# EAGLE design DCO (EAGLE 6.4)
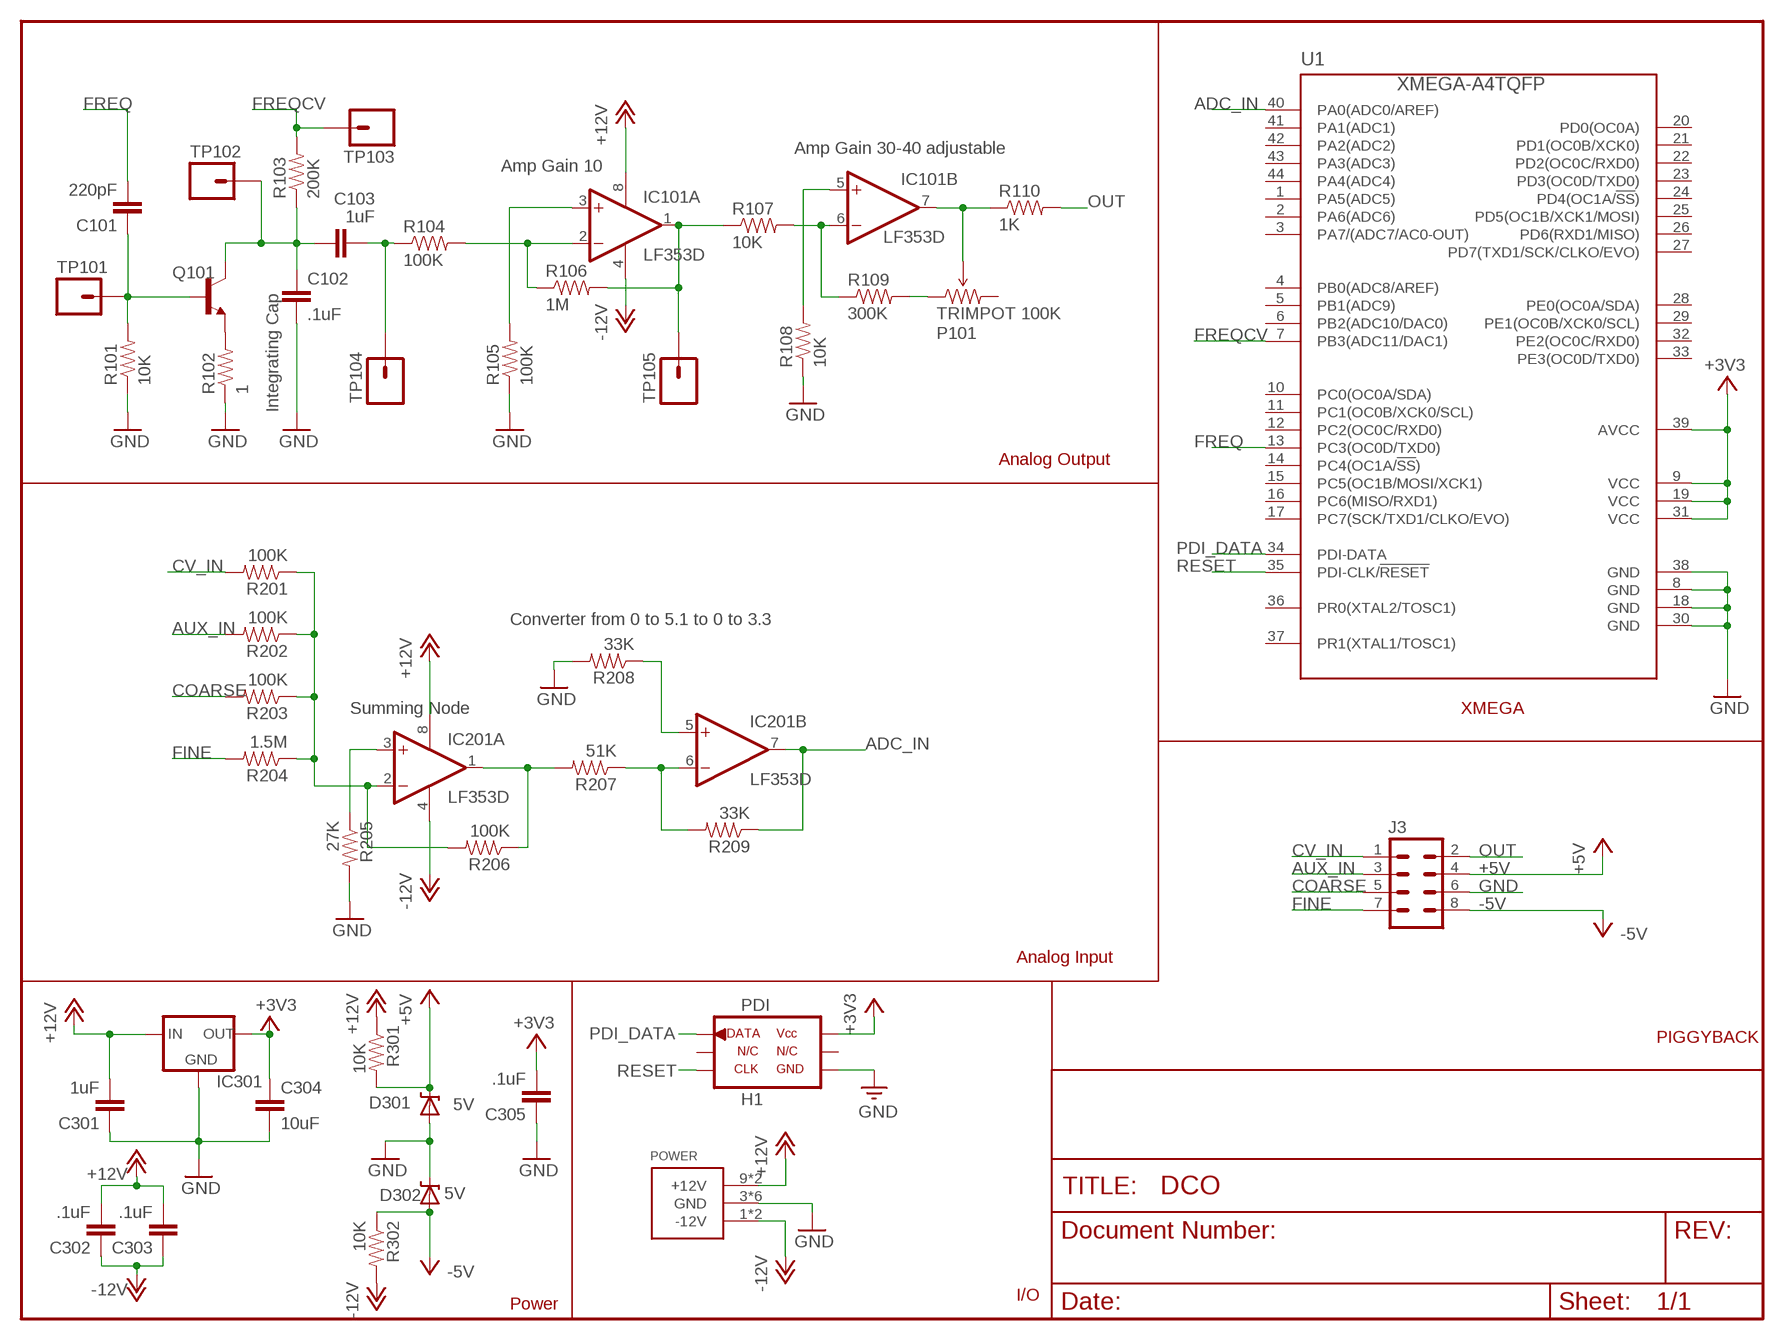
[diagram p0: schematic, sheet 1]

## Parts
C101  220pF  CAP0603-CAP  [0603-CAP]
C102  .1uF  CAP1210  [1210]
C103  1uF  CAP0805  [0805]
C301  1uF  CAP0805  [0805]
C302  .1uF  CAP0603-CAP  [0603-CAP]
C303  .1uF  CAP0603-CAP  [0603-CAP]
C304  10uF  CAP1206  [1206]
C305  .1uF  CAP0603-CAP  [0603-CAP]
D301  5V  DIODE-ZENER-BZT52  [SOD-323]
D302  5V  DIODE-ZENER-BZT52  [SOD-323]
H1  PDI  AVR_PDI_6  [AVR_ISP_6]
IC101  LF353D  [SO08]
IC201  LF353D  [SO08]
IC301  V_REG_MIC2920  [SOT223]
J3  M04X2  [2X4]
P101  TRIMPOT 100K  TRIMPOTPTH  [TRIM_POT_PTH]
POWER  POWER_SIMPLE16  [POWER_16]
Q101  TRANSISTOR_NPNSOT23  [SOT23]
R101  10K  RESISTOR0603-RES  [0603-RES]
R102  1  RESISTOR0805-RES  [0805]
R103  200K  RESISTOR0603-RES  [0603-RES]
R104  100K  RESISTOR0603-RES  [0603-RES]
R105  100K  RESISTOR0603-RES  [0603-RES]
R106  1M  RESISTOR0603-RES  [0603-RES]
R107  10K  RESISTOR0603-RES  [0603-RES]
R108  10K  RESISTOR0603-RES  [0603-RES]
R109  300K  RESISTOR0603-RES  [0603-RES]
R110  1K  RESISTOR0603-RES  [0603-RES]
R201  100K  RESISTOR0603-RES  [0603-RES]
R202  100K  RESISTOR0603-RES  [0603-RES]
R203  100K  RESISTOR0603-RES  [0603-RES]
R204  1.5M  RESISTOR0603-RES  [0603-RES]
R205  27K  RESISTOR0603-RES  [0603-RES]
R206  100K  RESISTOR0603-RES  [0603-RES]
R207  51K  RESISTOR0603-RES  [0603-RES]
R208  33K  RESISTOR0603-RES  [0603-RES]
R209  33K  RESISTOR0603-RES  [0603-RES]
R301  10K  RESISTOR0603-RES  [0603-RES]
R302  10K  RESISTOR0603-RES  [0603-RES]
TP101  M01PTH  [1X01]
TP102  M01PTH  [1X01]
TP103  M01PTH  [1X01]
TP104  M01PTH  [1X01]
TP105  M01PTH  [1X01]
U1  XMEGA-A4TQFP  [TQFP44]

## Nets
+3V3: C304.1 C305.2 H1.P$2(VCC_IO) IC301.3(OUT) U1.9(VCC) U1.19(VCC) U1.31(VCC) U1.39(AVCC)
+5V: D301.1(C) J3.4 R301.2
+12V: C301.2 C302.2 C303.2 IC101.8(P:V+) IC201.8(P:V+) IC301.1(IN) POWER.9(+12V) POWER.10(+12V) R301.1
-5V: D302.2(A) J3.8 R302.1
-12V: C302.1 C303.1 IC101.4(P:V-) IC201.4(P:V-) POWER.1(-12V) POWER.2(-12V) R302.2
ADC_IN: IC201.7(B:OUT) R209.1 U1.40(PA0(ADC0/AREF))
AUX_IN: J3.3 R202.2
COARSE: J3.5 R203.2
CV_IN: J3.1 R201.2
FINE: J3.7 R204.2
FREQ: C101.2 U1.13(PC3(OC0D/TXD0))
FREQCV: R103.2 TP103.1 U1.7(PB3(ADC11/DAC1))
GND: C102.2 C301.1 C304.2 C305.1 D301.2(A) D302.1(C) H1.P$6(GND) IC301.2(GND) J3.6 POWER.3(GND) POWER.4(GND) POWER.5(GND) POWER.6(GND) POWER.7(GND) POWER.8(GND) R101.1 R102.1 R105.1 R108.1 R205.2 R208.2 U1.8(GND) U1.18(GND) U1.30(GND) U1.38(GND)
N$1: C102.1 C103.1 Q101.3(C) R103.1 TP102.1
N$2: C101.1 Q101.1(B) R101.2 TP101.1
N$3: IC101.6(B:-IN) R107.2 R109.1
N$4: Q101.2(E) R102.2
N$5: C103.2 R104.1 TP104.1
N$6: IC201.3(A:+IN) R205.1
N$7: IC101.3(A:+IN) R105.2
N$10: IC101.5(B:+IN) R108.2
N$11: IC101.7(B:OUT) P101.2(WIPER) R110.1
N$12: P101.1(CCW) R109.2
N$13: IC101.1(A:OUT) R106.2 R107.1 TP105.1
N$17: IC201.1(A:OUT) R206.1 R207.2
N$19: IC201.6(B:-IN) R207.1 R209.2
N$21: IC201.5(B:+IN) R208.1
OUT: J3.2 R110.2
PDI_DATA: H1.P$1(DATA) U1.34(PDI-DATA)
R104: IC101.2(A:-IN) R104.2 R106.1
R205: IC201.2(A:-IN) R201.1 R202.1 R203.1 R204.1 R206.2
RESET: H1.P$5(CLK) U1.35(PDI-CLK/!RESET)
Unconnected: H1.P$3(NC1) H1.P$4(NC2) P101.3(CW) U1.1(PA5(ADC5)) U1.2(PA6(ADC6)) U1.3(PA7/(ADC7/AC0-OUT)) U1.4(PB0(ADC8/AREF)) U1.5(PB1(ADC9)) U1.6(PB2(ADC10/DAC0)) U1.10(PC0(OC0A/SDA)) U1.11(PC1(OC0B/XCK0/SCL)) U1.12(PC2(OC0C/RXD0)) U1.14(PC4(OC1A/!SS!)) U1.15(PC5(OC1B/MOSI/XCK1)) U1.16(PC6(MISO/RXD1)) U1.17(PC7(SCK/TXD1/CLKO/EVO)) U1.20(PD0(OC0A)) U1.21(PD1(OC0B/XCK0)) U1.22(PD2(OC0C/RXD0)) U1.23(PD3(OC0D/TXD0)) U1.24(PD4(OC1A/!SS!)) U1.25(PD5(OC1B/XCK1/MOSI)) U1.26(PD6(RXD1/MISO)) U1.27(PD7(TXD1/SCK/CLKO/EVO)) U1.28(PE0(OC0A/SDA)) U1.29(PE1(OC0B/XCK0/SCL)) U1.32(PE2(OC0C/RXD0)) U1.33(PE3(OC0D/TXD0)) U1.36(PR0(XTAL2/TOSC1)) U1.37(PR1(XTAL1/TOSC1)) U1.41(PA1(ADC1)) U1.42(PA2(ADC2)) U1.43(PA3(ADC3)) U1.44(PA4(ADC4))

## Notes on the sheet
- Amp Gain 30-40 adjustable
- Amp Gain 10
- Integrating Cap
- Analog Output
- Converter from 0 to 5.1 to 0 to 3.3
- Summing Node | XMEGA
- Analog Input
- PIGGYBACK
- I/O
- Power

## Library data of the parts
C101-C103 C301-C305 = SparkFun:CAP: Capacitor Standard 0603 ceramic capacitor, and 0.1" leaded capacitor.
D301 D302 = SparkFun:DIODE-ZENER: Zener Diode Production Part - 8199 3.4V Zener Voltage
H1 = Batten:AVR_PDI_6
IC101 IC201 = linear:LF353: OP AMP
IC301 = SparkFun:V_REG_MIC2920: MIC2920A (http://www.micrel.com/_PDF/mic2920.pdf) - 400mA output LDO Regulator
J3 = SparkFun:M04X2
P101 = SparkFun:TRIMPOT
POWER = eurorack:POWER_SIMPLE
Q101 = SparkFun:TRANSISTOR_NPN: Transistor NPN BJT configuration in SOT23 package. MMBT2222 is the common NPN we use. Double check BCE configuration again layout.
R101-R110 R201-R209 R301 R302 = SparkFun:RESISTOR: Resistor Basic schematic elements and footprints for 0603, 1206, and PTH resistors.
TP101-TP105 = SparkFun:M01: Header 1 Standard 1-pin 0.1" header. Use with straight break away headers (SKU : PRT-00116), right angle break away headers (PRT-00553), swiss pins (PRT-00743), machine pins (PRT-00117), and female headers (PRT-00115).
U1 = avr-7:XMEGA-A4: Atmel XMega A4 series processor

## Board
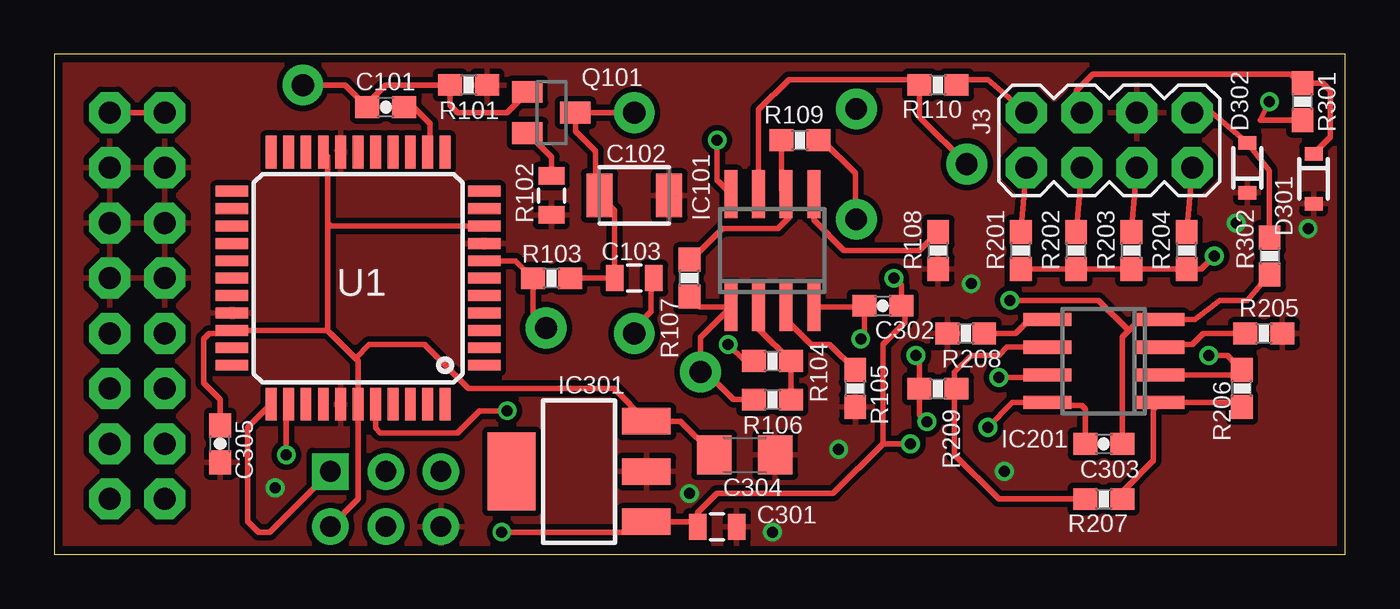
[diagram p1: board, top side]
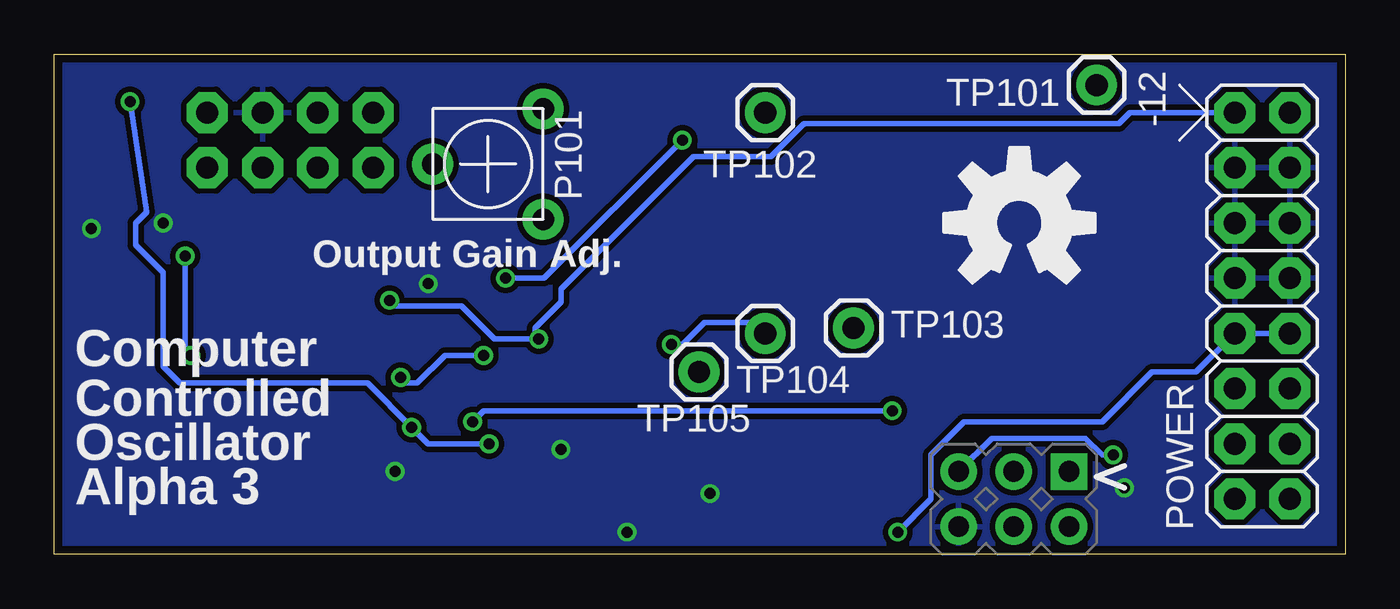
[diagram p2: board, bottom side, seen from below]

Size 59.36 x 23 mm. Coordinates in mm from the lower left corner, seen from the top.
Outline: 0,0 59.36,0 59.36,23 0,23 0,0
Copper layers (1*16): Top 0.0356mm / dielectric 1.5011mm / Bottom 0.0356mm
Design rules "default": minimum track width 6mil, minimum drill 13mil, track to track 6mil, track to pad 6mil, pad to pad 6mil, via to via 6mil, smd to smd 6mil, copper to edge 15mil, drill to drill 6mil, minimum pad ring 7mil, minimum via ring 7mil, stop-mask expansion 4mil, vias tented up to drill 0mil, thermal gap 10mil

### Footprints (pad centres in the part's own frame; a part is rotated, then mirrored left to right if it is on the bottom)
0603-CAP = smd 1.1 x 1: 1 -0.85,0; 2 0.85,0
1210 = smd 1.2 x 2: 1 -1.6,0; 2 1.6,0
0805 = smd 0.8 x 1.2: 1 -0.9,0; 2 0.9,0
1206 = smd 1.6 x 1.8: 1 -1.4,0; 2 1.4,0
SOD-323 = smd 0.63 x 0.83: 1 -1.15,0; 2 1.15,0
AVR_ISP_6 = drill 0.95 pad 1.676 square: P$1 -1.27,2.54 | drill 0.95 pad 1.676: P$2 1.27,2.54; P$3 -1.27,0; P$4 1.27,0; P$5 -1.27,-2.54; P$6 1.27,-2.54
SO08 = smd 0.6 x 2.2: 1 -1.905,-2.6; 2 -0.635,-2.6; 3 0.635,-2.6; 4 1.905,-2.6; 5 1.905,2.6; 6 0.635,2.6; 7 -0.635,2.6; 8 -1.905,2.6
SOT223 = smd 1.219 x 2.235: 1 -2.311,-3.099; 2 0,-3.099; 3 2.311,-3.099 | smd 3.6 x 2.2: 4 0,3.099
2X4 = drill 1.016 pad 1.88 octagon: 1 -3.81,-1.27; 2 -3.81,1.27; 3 -1.27,-1.27; 4 -1.27,1.27; 5 1.27,-1.27; 6 1.27,1.27; 7 3.81,-1.27; 8 3.81,1.27
TRIM_POT_PTH = drill 1 pad 1.88: 1 -2.54,-2.54; 2 0,2.54; 3 2.54,-2.54
POWER_16 = drill 1.016 pad 1.88 octagon: 1 -6.35,-1.27; 2 -6.35,1.27; 3 -3.81,-1.27; 4 -3.81,1.27; 5 -1.27,-1.27; 6 -1.27,1.27; 7 1.27,-1.27; 8 1.27,1.27; 9 3.81,-1.27; 10 3.81,1.27; 11 6.35,-1.27; 12 6.35,1.27; 13 8.89,-1.27; 14 8.89,1.27; 15 11.43,-1.27; 16 11.43,1.27
SOT23 = smd 1 x 1.4: 1 -0.95,-1.1; 2 0.95,-1.1; 3 0,1.1
0603-RES = smd 1.1 x 1: 1 -0.85,0; 2 0.85,0
1X01 = drill 1.016 pad 1.88: 1 0,0
TQFP44 = smd 1.5 x 0.5: 1 -5.8,4; 2 -5.8,3.2; 3 -5.8,2.4; 4 -5.8,1.6; 5 -5.8,0.8; 6 -5.8,0; 7 -5.8,-0.8; 8 -5.8,-1.6; 9 -5.8,-2.4; 10 -5.8,-3.2; 11 -5.8,-4; 23 5.8,-4; 24 5.8,-3.2; 25 5.8,-2.4; 26 5.8,-1.6; 27 5.8,-0.8; 28 5.8,0; 29 5.8,0.8; 30 5.8,1.6; 31 5.8,2.4; 32 5.8,3.2; 33 5.8,4 | smd 0.5 x 1.5: 12 -4,-5.8; 13 -3.2,-5.8; 14 -2.4,-5.8; 15 -1.6,-5.8; 16 -0.8,-5.8; 17 0,-5.8; 18 0.8,-5.8; 19 1.6,-5.8; 20 2.4,-5.8; 21 3.2,-5.8; 22 4,-5.8; 34 4,5.8; 35 3.2,5.8; 36 2.4,5.8; 37 1.6,5.8; 38 0.8,5.8; 39 0,5.8; 40 -0.8,5.8; 41 -1.6,5.8; 42 -2.4,5.8; 43 -3.2,5.8; 44 -4,5.8

### Placement (x,y rotation side)
C101  15.24,20.57 0 top
C102  26.67,16.51 0 top
C103  26.67,12.7 0 top
C301  30.48,1.27 180 top
C302  38.1,11.43 0 top
C303  48.26,5.08 180 top
C304  31.75,4.57 0 top
C305  7.62,5.08 90 top
D301  57.91,17.27 270 top
D302  54.86,17.78 90 top
H1  15.24,2.54 270 bottom
IC101  33.02,13.97 0 top
IC201  48.26,8.89 90 top
IC301  24.13,3.81 90 top
J3  48.51,19.05 0 top
P101  39.42,17.95 90 bottom
POWER  3.81,13.97 270 bottom
Q101  22.86,20.32 270 top
R101  19.05,21.59 180 top
R102  22.86,16.51 90 top
R103  22.86,12.7 180 top
R104  33.02,8.89 0 top
R105  36.83,7.62 90 top
R106  33.02,7.11 180 top
R107  29.21,12.7 90 top
R108  40.64,13.97 90 top
R109  34.29,19.05 0 top
R110  40.64,21.59 0 top
R201  44.45,13.97 90 top
R202  46.99,13.97 90 top
R203  49.53,13.97 90 top
R204  52.07,13.97 90 top
R205  55.63,10.16 0 top
R206  54.61,7.62 90 top
R207  48.26,2.54 0 top
R208  41.91,10.16 180 top
R209  40.64,7.62 0 top
R301  57.4,20.83 90 top
R302  55.88,13.72 270 top
TP101  11.43,21.59 0 bottom
TP102  26.67,20.32 0 bottom
TP103  22.61,10.41 0 bottom
TP104  26.67,10.16 0 bottom
TP105  29.72,8.38 0 bottom
U1  13.97,12.7 180 top
U$1  [OSHW-LOGO-L]  14.99,15.24 0 bottom

### Tracks (layer width: path | path; a pad name or v marks a point on that pad's centre or on a via)
+3V3
  Top 0.254: H1.P$2 13.97,2.54 U1.39 13.97,8.89 13.84,9.02 | 12.56,10.3 U1.31 8.03,10.16 7.11,10.16 6.86,9.91 6.86,7.87 7.62,7.11 C305.2 | 12.56,10.3 13.84,9.02 | 12.56,10.3 12.56,15.24 | 12.56,15.24 12.56,18.31 U1.19 | U1.9 12.7,15.1 12.56,15.24 | 13.84,9.02 14.48,9.65 17.02,9.65 19.05,7.62 25.73,7.62 IC301.3 28.8,6.12 C304.1
+5V
  Top 0.254: J3.4 46.99,21.34 47.75,22.1 56.9,22.1 56.9,22.01 R301.2 58.33,21.68 58.67,21.34 58.67,19.18 D301.1
+12V  (via drill 0.51)
  Top 0.254: C303.2 47.41,6.69 47.24,6.86 45.79,6.86 IC201.8 44.07,6.99 v42.93,5.84 | v20.57,1.02 26.75,1.02 IC301.1 29.35,1.5 C301.2 29.58,1.89 30.48,2.79 35.81,2.79 38.1,5.08 | 38.1,5.08 38.1,9.65 39.12,10.67 39.12,11.26 C302.2 38.95,12.36 v38.61,12.7 | v30.48,19.05 30.48,17.2 IC101.8 | v39.37,5.08 38.1,5.08 | R301.1 55.46,19.98 v55.88,20.83
  Bottom 0.254: POWER.10 POWER.9 6.86,8.38 8.89,8.38 11.18,6.1 17.53,6.1 19.05,4.57 19.05,2.54 v20.57,1.02 | v38.61,12.7 36.83,12.7 v30.48,19.05 | v39.37,5.08 42.16,5.08 v42.93,5.84 44.96,7.87 53.59,7.87 54.36,8.64 54.36,12.95 55.63,14.22 55.63,15.24 55.12,15.75 v55.88,20.83
-5V
  Top 0.254: J3.8 53.22,20.32 D302.2 55.88,17.66 R302.1
-12V  (via drill 0.51)
  Top 0.254: C303.1 49.11,9.99 49.4,10.29 | 49.4,10.29 49.78,10.67 50.73,10.67 IC201.4 52.45,10.79 53.59,11.68 54.86,11.68 R302.2 | POWER.2 POWER.1 | IC101.4 37.19,11.37 C302.1 37.25,10.07 v37.08,9.91 | v43.94,11.68 48.01,11.68 49.4,10.29
  Bottom 0.254: v43.94,11.68 43.69,11.43 40.64,11.43 39.12,9.91 v37.08,9.91 37.25,10.07 37.25,10.41 36.07,11.6 36.07,12.19 29.97,18.29 26.42,18.29 24.89,19.81 10.41,19.81 9.91,20.32 POWER.1
ADC_IN  (via drill 0.51)
  Top 0.254: U1.40 14.77,5.8 14.99,5.59 18.54,5.59 19.56,6.6 v20.83,6.6 | v40.13,6.1 39.79,6.44 R209.1 39.79,8.98 v39.62,9.14 | v43.43,8.13 45.53,8.13 IC201.7
  Bottom 0.254: v20.83,6.6 39.62,6.6 v40.13,6.1 | v39.62,9.14 41.4,9.14 42.67,7.87 43.18,7.87 v43.43,8.13
AUX_IN
  Top 0.254: J3.3 R202.2
COARSE
  Top 0.254: R203.2 J3.5
CV_IN
  Top 0.254: R201.2 J3.1
FINE
  Top 0.254: R204.2 J3.7
FREQ
  Top 0.254: C101.2 16.51,20.57 17.27,19.81 17.27,18.6 U1.13
FREQCV
  Top 0.254: U1.7 21.21,13.5 R103.2 22.01,11.01 TP103.1
GND  (via drill 0.51)
  other vias: 43.69,3.81 10.16,3.05 33.02,1.02 29.21,2.79 36.07,4.83 42.16,12.45 57.66,14.99 54.36,15.24
  pour Bottom (isolate 0.254): 0,23 0,0 59.36,0 59.36,23
  pour Top (isolate 0.254): 0,23 59.36,23 59.36,0 0,0
N$1
  Top 0.254: TP102.1 Q101.3 23.96,19.47 24.89,18.54 24.89,16.69 C102.1 25.77,15.81 C103.1 R103.1
N$2
  Top 0.254: TP101.1 13.37,21.59 C101.1 14.39,20.74 15.24,21.59 R101.2 18.2,20.66 18.54,20.32 20.81,20.32 Q101.1
N$3
  Top 0.254: R109.1 33.44,16.79 IC101.6 33.78,16.44 33.78,15.49 33.27,14.99 30.73,14.99 29.3,13.55 R107.2
N$4
  Top 0.254: R102.2 22.86,18.27 Q101.2
N$5  (via drill 0.51)
  Top 0.254: TP104.1 26.67,10.41 27.43,11.18 27.43,12.56 C103.2 | R104.1 31.75,8.89 v30.99,9.65
  Bottom 0.254: v30.99,9.65 30.48,9.65 29.46,10.67 27.18,10.67 TP104.1
N$6
  Top 0.254: R205.1 52.83,10.16 52.32,9.65 50.99,9.65 IC201.3
N$7
  Top 0.254: IC101.3 33.66,10.79 34.8,9.65 35.65,9.65 R105.2
N$10
  Top 0.254: IC101.5 34.92,15.37 36.32,13.97 39.79,13.97 R108.2
N$11
  Top 0.254: P101.2 39.79,20.12 R110.1 39.54,21.84 33.78,21.84 32.38,20.45 IC101.7
N$12
  Top 0.254: R109.2 35.31,19.05 36.83,17.53 36.83,15.46 P101.1
N$13
  Top 0.254: R106.2 31.24,7.11 29.97,8.38 TP105.1 29.72,9.97 IC101.1 29.69,11.37 R107.1
N$17
  Top 0.254: R207.2 49.11,2.88 50.55,4.32 50.55,6.67 IC201.1 54.4,6.99 R206.1
N$19
  Top 0.254: IC201.6 43.81,9.53 43.43,9.14 42.16,9.14 41.4,8.38 41.4,7.71 R209.2 41.4,7.53 41.4,4.57 43.43,2.54 R207.1
N$21
  Top 0.254: R208.1 44.2,10.16 44.7,10.67 45.53,10.67 IC201.5
OUT
  Top 0.254: J3.2 42.93,21.84 41.74,21.84 R110.2
PDI_DATA
  Top 0.254: H1.P$1 9.91,1.02 9.4,1.02 8.89,1.52 8.89,5.84 9.95,6.9 U1.34
R104
  Top 0.254: IC101.2 32.38,10.38 R104.2 R106.1
R205  (via drill 0.51)
  Top 0.254: IC201.2 54.4,8.26 R206.2 53.94,9.14 v53.09,9.14 | R201.1 R202.1 R203.1 R204.1 52.74,13.12 v53.34,13.72
  Bottom 0.254: v53.34,13.72 53.34,9.4 v53.09,9.14
RESET  (via drill 0.51)
  Top 0.254: U1.35 10.67,6.8 v10.67,4.57
  Bottom 0.254: v10.67,4.57 11.18,4.57 11.94,5.33 16.26,5.33 H1.P$5

### Text on the board
bPlace: Output Gain Adj. | Computer | Controlled | Oscillator | Alpha 3